# Altium schematic sheet Flash_EEPROM_Memory.SchDoc
size A4; DrawnBy: Hanif; DocumentNumber: 2; SheetNumber: 2; SheetTotal: 8
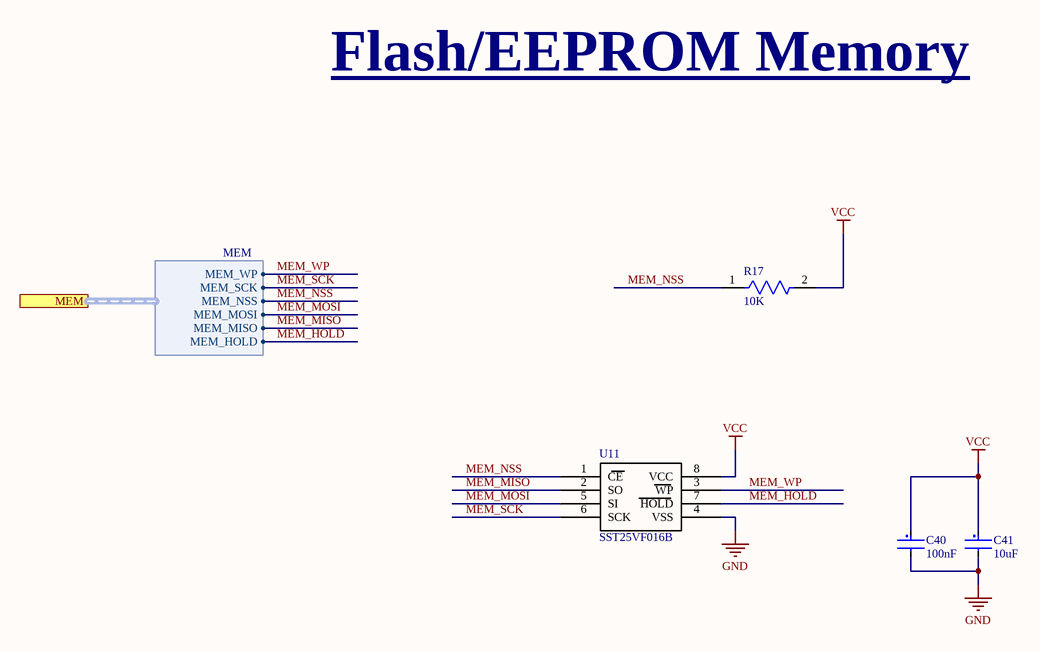
[diagram p0: Flash_EEPROM_Memory.SchDoc]

## Parts
C40  100nF  [Samsung_CL31_IPC_A_1206]
C41  10uF  [Samsung_CL31_IPC_A_1206]
R17  10K  [YAGEO_RC1206-0_65_IPC_A]
U11  SST25VF016B  [SOIC-8]

## Ports
MEM (harness MEM)

## Harnesses
MEM: MEM_MISO, MEM_MOSI, MEM_NSS, MEM_SCK, MEM_WP, MEM_HOLD

## Nets
GND: C40.2 C41.2 U11.4(VSS)
VCC: C40.1 C41.1 R17.2 U11.8(VCC)
MEM_HOLD: U11.7(HOLD) ; port MEM.MEM_HOLD
MEM_MISO: U11.2(SO) ; port MEM.MEM_MISO
MEM_MOSI: U11.5(SI) ; port MEM.MEM_MOSI
MEM_NSS: R17.1 U11.1(CE) ; port MEM.MEM_NSS
MEM_SCK: U11.6(SCK) ; port MEM.MEM_SCK
MEM_WP: U11.3(WP) ; port MEM.MEM_WP

## Notes on the sheet
- Flash/EEPROM Memory
- Project Name:
- Size:
- Date:
- A4
- Doc Num:
- Time:
- Version:
- Sheet
- of
- File:
- Drawn by:

## Library data of the parts
C40 = CL31B104KBCNFNC: CAP CER 0.1UF 50V X7R 1206, ±10% 50V Ceramic Capacitor X7R 1206 (3216 Metric); Supplier 1: Digi-Key; Supplier Part Number 1: 1276-2744-1-ND
C41 = CL31A106KQHNNWE: CAP CER 10UF 6.3V X5R 1206, ±10% 6.3V Ceramic Capacitor X5R 1206 (3216 Metric); Supplier 1: Digi-Key; Supplier Part Number 1: 1276-3043-1-ND
R17 = RC1206JR-071KL: 1 ±5% 0.25W, 1/4W Chip Resistor 1206 (3216 Metric) Moisture Resistant Thick Film; Supplier 1: Digi-Key; Supplier Part Number 1: 311-1.0KERCT-ND